# Altium schematic sheet night-CH.SchDoc
size A4
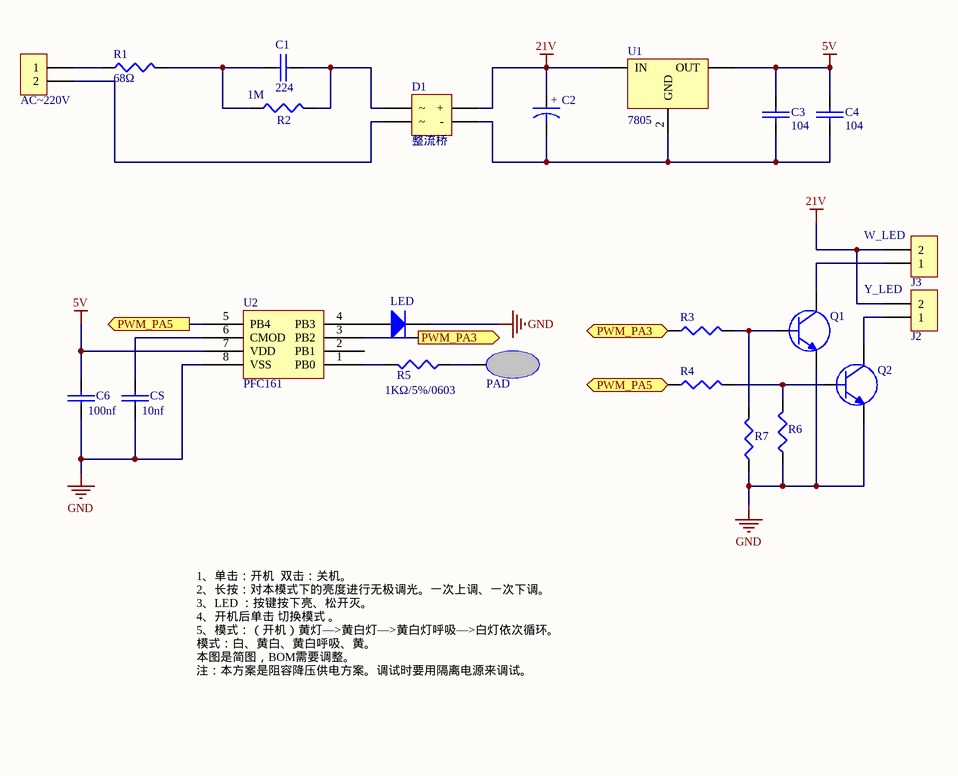
[diagram p0: night-CH.SchDoc]

## Parts
AC~220V  CON  [CONNECTOR]  (value not drawn)
C1  104/10%/50V/0603/X7R  [0603]  (value not drawn)
C2  47uF/20%/35V/6.3*5.4  [PCBComponent_1]  (value not drawn)
C3  104/10%/50V/0603/X7R  [0603]  (value not drawn)
C4  104/10%/50V/0603/X7R  [0603]  (value not drawn)
C6  104/10%/50V/0603/X7R  [0603]  (value not drawn)
CS  104/10%/50V/0603/X7R  [0603]  (value not drawn)
D1  整流桥
J2  Y_LED  [CONNECTOR]
J3  W_LED  [CONNECTOR]
LED  1N4148  [SOD-123]  (value not drawn)
PAD  TP  [TP2]  (value not drawn)
Q1  S8050/SOT23  [SOT23]  (value not drawn)
Q2  S8050/SOT23  [SOT23]  (value not drawn)
R1  1KΩ/5%/0603  [0402]  (value not drawn)
R2  1M  [0402]
R3  1KΩ/5%/0603  [0402]  (value not drawn)
R4  1KΩ/5%/0603  [0402]  (value not drawn)
R5  1KΩ/5%/0603  [0402]
R6  1KΩ/5%/0603  [0402]  (value not drawn)
R7  1KΩ/5%/0603  [0402]  (value not drawn)
U1  7805
U2  PFC161

## Ports
PWM_PA3, PWM_PA3 (out), PWM_PA5, PWM_PA5 (out)

## Nets
5V: C3.2 C4.2 C6.2 U1.1(OUT) U2.7(VDD)
21V: C2.1 D1.2(+) J2.2 J3.2 U1.1(IN)
GND: C6.1 CS.1 LED.2 Q1.3(E) Q2.3(E) R6.1 R7.1 U2.8(VSS)
PWM_PA3: R3.1 U2.3(PB2) ; port PWM_PA3
PWM_PA5: R4.1 U2.5(PB4) ; port PWM_PA5
NetAC~220V_1: AC~220V.1 R1.1
NetAC~220V_2: AC~220V.2 D1.1
NetC1_1: C1.1 R1.2 R2.1
NetC1_2: C1.2 D1.?1 R2.2
NetC2_2: C2.2 C3.1 C4.1 D1.3(-) U1.2(GND)
NetCS_2: CS.2 U2.6(CMOD)
NetJ2_1: J2.1 Q2.2(C)
NetJ3_1: J3.1 Q1.2(C)
NetLED_1: LED.1 U2.4(PB3)
NetPAD_?1: PAD.?1 R5.1
NetQ1_1: Q1.1(B) R3.2 R7.2
NetQ2_1: Q2.1(B) R4.2 R6.2
NetR5_2: R5.2 U2.1(PB0)

Not connected (* = marked no-connect by the designer): U2 2(PB1)

## Notes on the sheet
- 1、单击：开机  双击：关机。
  2、长按：对本模式下的亮度进行无极调光。一次上调、一次下调。
  3、LED ：按键按下亮、松开灭。
  4、开机后单击 切换模式 。
  5、模式：（开机）黄灯—>黄白灯—>黄白灯呼吸—>白灯依次循环。
  模式：白、黄白、黄白呼吸、黄。
  本图是简图，BOM需要调整。
  注：本方案是阻容降压供电方案。调试时要用隔离电源来调试。
- (in symbol CAP) 224; 104; 100nf; 10nf
- (in symbol CAPACITOR POL) +
- (in symbol RES) 68Ω

## Library data of the parts
AC~220V J2 J3 = CON: 插座
C1 C3 C4 C6 CS = CAP: 贴片瓷片电容
C2 = CAPACITOR POL: 贴片电解电容
LED = DIODE: 整流二极管
PAD = PAD1: 椭圆形触摸PAD
Q1 Q2 = NPN: 贴片NPN三极管
R1-R7 = RES: 贴片电阻
U2 = HC8T0405